# EAGLE design LB_o9_Bargraph-v03(3_3) (EAGLE 6.6.0)
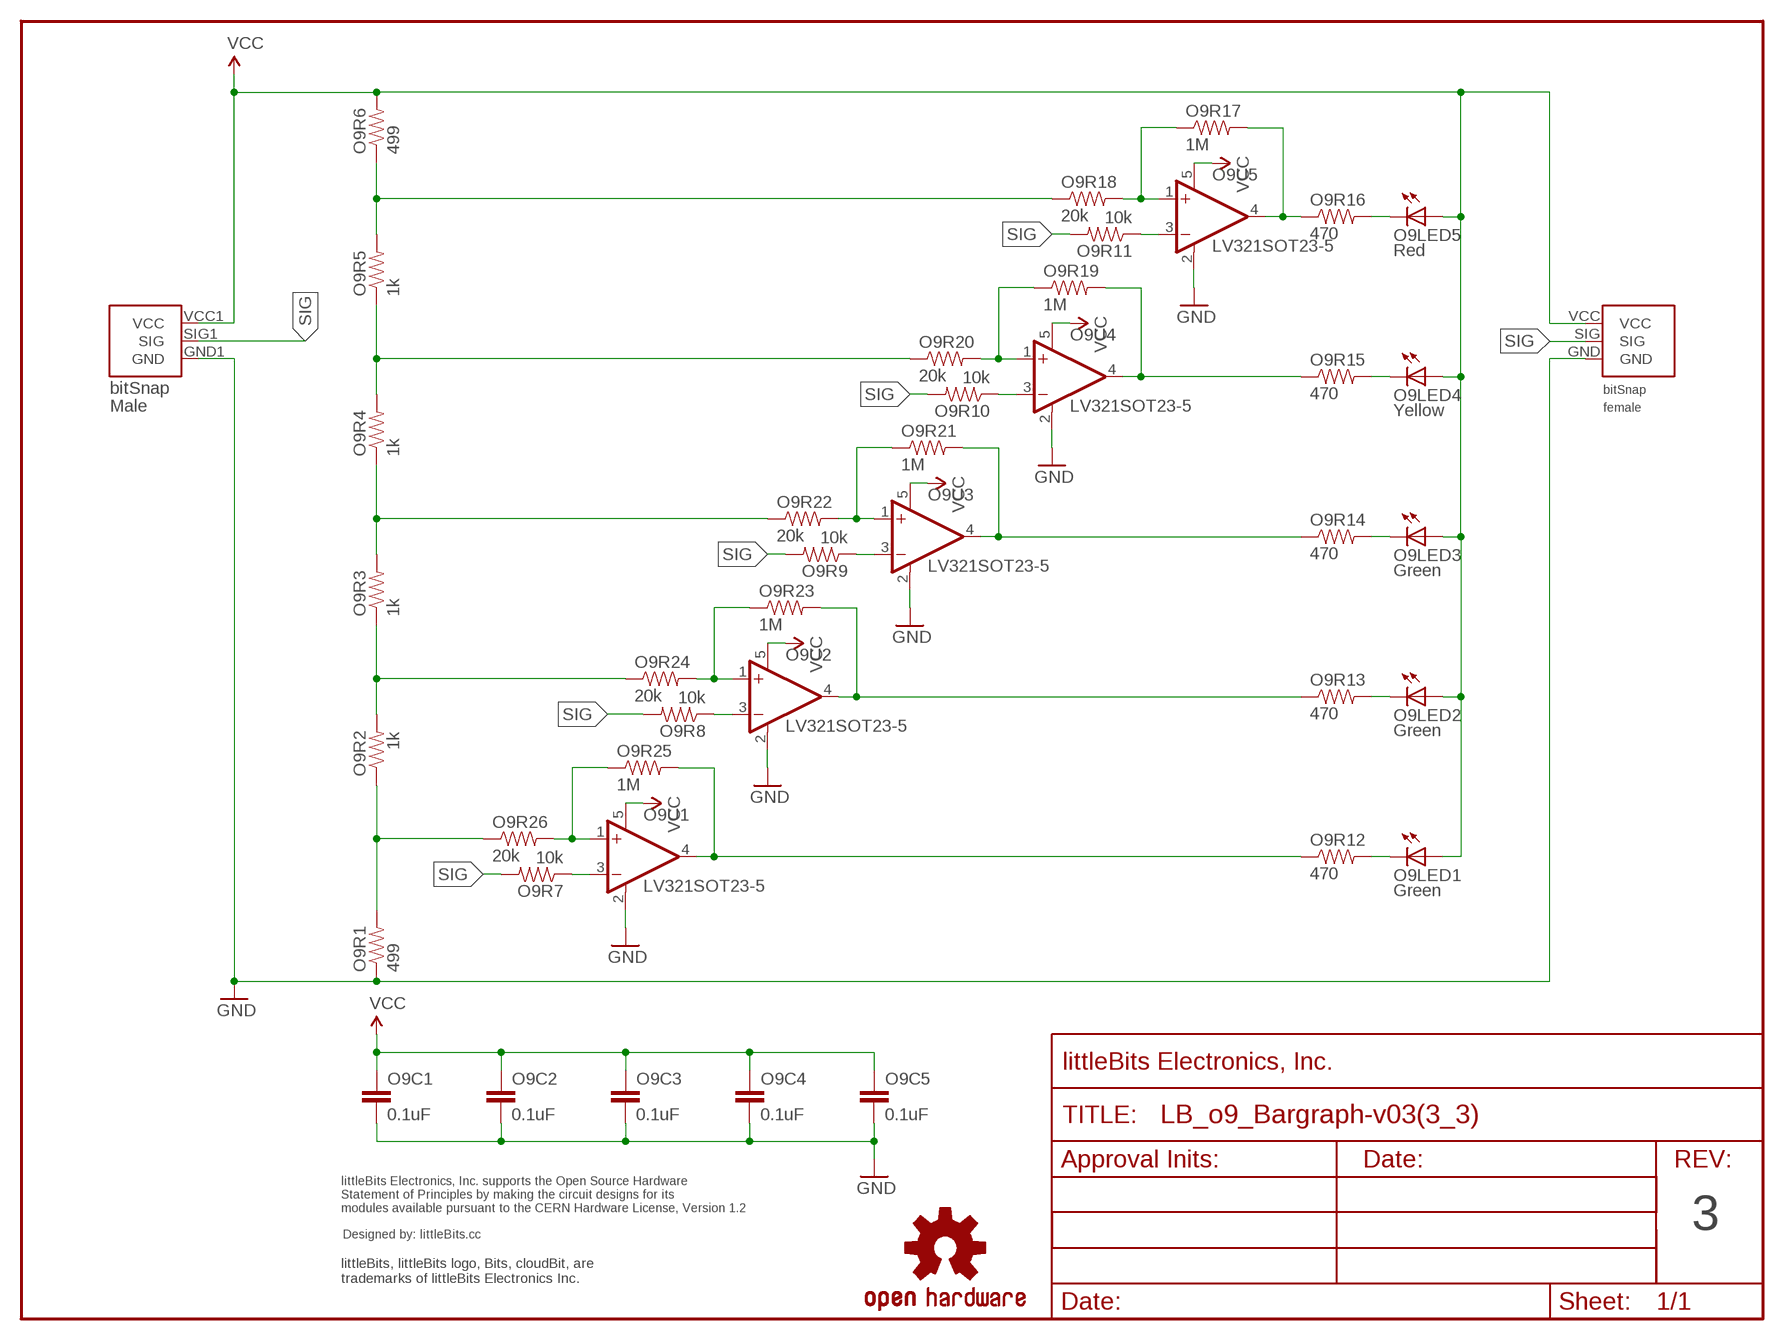
[diagram p0: schematic, sheet 1]

## Parts
09BSF1  BITSNAP_V03_FEMALE  [BITSNAP_V03_FEMALE]
O9BSM1  BITSNAP_V03_MALE  [BITSNAP_V03_MALE]
O9C1  0.1uF  CAP0603-CAP  [0603-CAP]
O9C2  0.1uF  CAP0603-CAP  [0603-CAP]
O9C3  0.1uF  CAP0603-CAP  [0603-CAP]
O9C4  0.1uF  CAP0603-CAP  [0603-CAP]
O9C5  0.1uF  CAP0603-CAP  [0603-CAP]
O9LED1  Green  LED1206  [LED-1206]
O9LED2  Green  LED1206  [LED-1206]
O9LED3  Green  LED1206  [LED-1206]
O9LED4  Yellow  LED1206  [LED-1206]
O9LED5  Red  LED1206  [LED-1206]
O9R1  499  RESISTOR0603-RES  [0603-RES]
O9R2  1k  RESISTOR0603-RES  [0603-RES]
O9R3  1k  RESISTOR0603-RES  [0603-RES]
O9R4  1k  RESISTOR0603-RES  [0603-RES]
O9R5  1k  RESISTOR0603-RES  [0603-RES]
O9R6  499  RESISTOR0603-RES  [0603-RES]
O9R7  10k  RESISTOR0603-RES  [0603-RES]
O9R8  10k  RESISTOR0603-RES  [0603-RES]
O9R9  10k  RESISTOR0603-RES  [0603-RES]
O9R10  10k  RESISTOR0603-RES  [0603-RES]
O9R11  10k  RESISTOR0603-RES  [0603-RES]
O9R12  470  RESISTOR0603-RES  [0603-RES]
O9R13  470  RESISTOR0603-RES  [0603-RES]
O9R14  470  RESISTOR0603-RES  [0603-RES]
O9R15  470  RESISTOR0603-RES  [0603-RES]
O9R16  470  RESISTOR0603-RES  [0603-RES]
O9R17  1M  RESISTOR0603-RES  [0603-RES]
O9R18  20k  RESISTOR0603-RES  [0603-RES]
O9R19  1M  RESISTOR0603-RES  [0603-RES]
O9R20  20k  RESISTOR0603-RES  [0603-RES]
O9R21  1M  RESISTOR0603-RES  [0603-RES]
O9R22  20k  RESISTOR0603-RES  [0603-RES]
O9R23  1M  RESISTOR0603-RES  [0603-RES]
O9R24  20k  RESISTOR0603-RES  [0603-RES]
O9R25  1M  RESISTOR0603-RES  [0603-RES]
O9R26  20k  RESISTOR0603-RES  [0603-RES]
O9U1  LV321SOT23-5  [SOT23-5]
O9U2  LV321SOT23-5  [SOT23-5]
O9U3  LV321SOT23-5  [SOT23-5]
O9U4  LV321SOT23-5  [SOT23-5]
O9U5  LV321SOT23-5  [SOT23-5]
U$1  OSHWCREDIT  [OSHWCREDIT]
U$2  FRAME-LETTER-OHWOHW  [FABDWG01-OHW]
U$4  OSHW-LOGOL  [OSHW-LOGO-L]

## Nets
GND: 09BSF1.GND O9BSM1.GND1(GND) O9C1.2 O9C2.2 O9C3.2 O9C4.2 O9C5.2 O9R1.1 O9U1.2(V-) O9U2.2(V-) O9U3.2(V-) O9U4.2(V-) O9U5.2(V-)
N$1: O9R7.1 O9U1.3(-IN)
N$2: O9LED1.C O9R12.2
N$3: O9LED2.C O9R13.2
N$4: O9LED3.C O9R14.2
N$5: O9LED4.C O9R15.2
N$6: O9R16.1 O9R17.2 O9U5.4(OUT)
N$7: O9R11.1 O9U5.3(-IN)
N$8: O9LED5.C O9R16.2
N$9: O9R17.1 O9R18.2 O9U5.1(+IN)
N$10: O9R15.1 O9R19.2 O9U4.4(OUT)
N$11: O9R10.1 O9U4.3(-IN)
N$12: O9R19.1 O9R20.2 O9U4.1(+IN)
N$13: O9R21.1 O9R22.2 O9U3.1(+IN)
N$14: O9R1.2 O9R2.1 O9R26.1
N$15: O9R2.2 O9R3.1 O9R24.1
N$16: O9R3.2 O9R4.1 O9R22.1
N$17: O9R4.2 O9R5.1 O9R20.1
N$18: O9R9.1 O9U3.3(-IN)
N$19: O9R14.1 O9R21.2 O9U3.4(OUT)
N$20: O9R5.2 O9R6.1 O9R18.1
N$21: O9R8.1 O9U2.3(-IN)
N$22: O9R23.1 O9R24.2 O9U2.1(+IN)
N$23: O9R13.1 O9R23.2 O9U2.4(OUT)
N$24: O9R12.1 O9R25.2 O9U1.4(OUT)
N$26: O9R25.1 O9R26.2 O9U1.1(+IN)
SIG: 09BSF1.SIG O9BSM1.SIG1(SIG) O9R7.2 O9R8.2 O9R9.2 O9R10.2 O9R11.2
VCC: 09BSF1.VCC O9BSM1.VCC1(VCC) O9C1.1 O9C2.1 O9C3.1 O9C4.1 O9C5.1 O9LED1.A O9LED2.A O9LED3.A O9LED4.A O9LED5.A O9R6.2 O9U1.5(V+) O9U2.5(V+) O9U3.5(V+) O9U4.5(V+) O9U5.5(V+)

## Notes on the sheet
- 3

## Library data of the parts
09BSF1 = bitSnap:BITSNAP_V03_FEMALE
O9BSM1 = bitSnap:BITSNAP_V03_MALE
O9C1-O9C5 = SparkFun:CAP: Capacitor Standard 0603 ceramic capacitor, and 0.1" leaded capacitor.
O9LED1-O9LED5 = SparkFun:LED: LEDs Standard schematic elements and footprints for 5mm, 3mm, 1206, and 0603 sized LEDs. 5mm - Spark Fun Electronics SKU : COM-00529 (and others)
O9R1-O9R26 = SparkFun:RESISTOR: Resistor Basic schematic elements and footprints for 0603, 1206, and PTH 1/10th watt (small) resistors.
O9U1-O9U5 = LITTLEBITS:LV321
U$1 = LITTLEBITS:OSHWCREDIT
U$2 = LITTLEBITS:FRAME-LETTER-OHW
U$4 = LITTLEBITS:OSHW-LOGO: Open Source Hardware Logo This logo indicates the piece of hardware it is found on incorporates a OSHW license and/or adheres to the definition of open source hardware found here: http://freedomdefined.org/OSHW

## Board
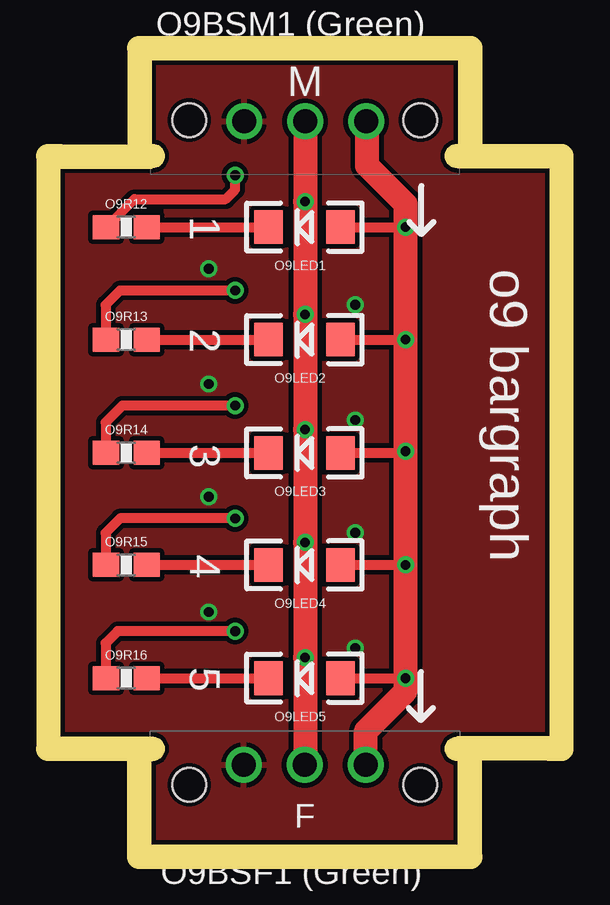
[diagram p1: board, top side]
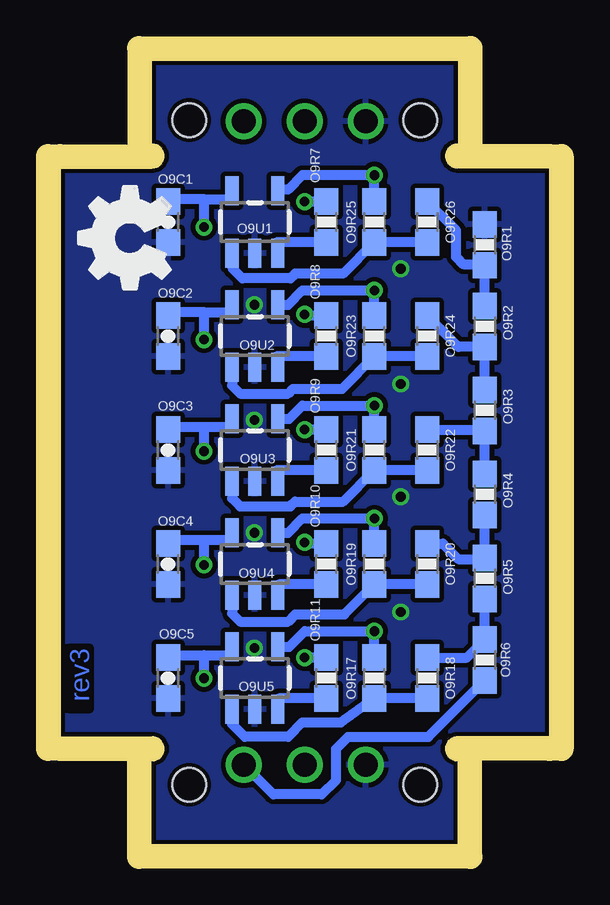
[diagram p2: board, bottom side, seen from below]

Size 20.4 x 32.7 mm. Coordinates in mm from the lower left corner, seen from the top.
Outline: 0,4.5 0,28.2
Outline: 20.4,28.2 20.4,4.5
Copper layers (1*16): Top 0.035mm / dielectric 1.5mm / Bottom 0.035mm
Design rules "default": minimum track width 0.2mm, minimum drill 0.4mm, track to track 0.2mm, track to pad 0.2mm, pad to pad 0.2mm, via to via 0.2mm, smd to smd 0mil, copper to edge 0.2mm, drill to drill 0.2mm, minimum pad ring 0.2mm, minimum via ring 0.15mm, stop-mask expansion 0.1mm, vias tented up to drill 0mil, thermal gap 0.2mm
Milling: 6 lines

### Footprints (pad centres in the part's own frame; a part is rotated, then mirrored left to right if it is on the bottom)
BITSNAP_V03_FEMALE = drill 1: GND 3.91,3.33; SIG 6.45,3.33; VCC 8.99,3.33 | hole 1.4: 1.63,2.5; 11.27,2.5
BITSNAP_V03_MALE = drill 1: GND1 8.98,2.56; SIG1 6.44,2.56; VCC1 3.9,2.56 | hole 1.4: 11.27,2.5; 1.63,2.5
0603-CAP = smd 1.1 x 1: 1 -0.85,0; 2 0.85,0
LED-1206 = smd 1.2 x 1.4: A -1.5,0; C 1.5,0
0603-RES = smd 1.1 x 1: 1 -0.85,0; 2 0.85,0
SOT23-5 = smd 0.55 x 1.2: 1 -0.95,-1.3; 2 0,-1.3; 3 0.95,-1.3; 4 0.95,1.3; 5 -0.95,1.3

### Placement (x,y rotation side)
09BSF1  3.75,0 0 top
O9BSM1  16.65,32.7 180 top
O9C1  15.9,25.95 270 bottom
O9C2  15.9,21.2 270 bottom
O9C3  15.9,16.45 270 bottom
O9C4  15.9,11.7 270 bottom
O9C5  15.9,6.95 270 bottom
O9LED1  10.19,25.74 180 top
O9LED2  10.19,21.05 180 top
O9LED3  10.19,16.33 180 top
O9LED4  10.19,11.66 180 top
O9LED5  10.19,6.94 180 top
O9R1  2.7,25 270 bottom
O9R2  2.7,21.6 270 bottom
O9R3  2.7,18.1 270 bottom
O9R4  2.7,14.6 270 bottom
O9R5  2.7,11.1 270 bottom
O9R6  2.7,7.7 270 bottom
O9R7  9.3,25.95 90 bottom
O9R8  9.3,21.2 90 bottom
O9R9  9.3,16.45 90 bottom
O9R10  9.3,11.7 90 bottom
O9R11  9.3,6.95 90 bottom
O9R12  2.76,25.74 0 top
O9R13  2.76,21.05 0 top
O9R14  2.76,16.33 0 top
O9R15  2.76,11.66 0 top
O9R16  2.76,6.94 0 top
O9R17  7.3,6.95 90 bottom
O9R18  5.1,6.95 270 bottom
O9R19  7.3,11.7 90 bottom
O9R20  5.1,11.7 270 bottom
O9R21  7.3,16.45 90 bottom
O9R22  5.1,16.45 270 bottom
O9R23  7.3,21.2 90 bottom
O9R24  5.1,21.2 270 bottom
O9R25  7.3,25.95 90 bottom
O9R26  5.1,25.95 270 bottom
O9U1  12.28,25.95 0 bottom
O9U2  12.28,21.2 0 bottom
O9U3  12.28,16.45 0 bottom
O9U4  12.28,11.7 0 bottom
O9U5  12.28,6.95 0 bottom
U$1  -93.8,-65.3 0 top  (outside the outline)
U$2  0.1,0.1 0 top
U$4  -31.3,-70.9 0 top  (outside the outline)
U$10  [OSHW_FILLX150_NOTEXT]  15.81,22.33 0 top

### Tracks (layer width: path | path; a pad name or v marks a point on that pad's centre or on a via)
GND  (via drill 0.41)
  other vias: 12.3,22.5 12.3,17.7 12.3,13 12.3,8.2 6.2,24 6.2,19.2 6.2,14.5 6.2,9.7
  pour Top: 0.15,32.54 0.15,0.15 20.22,0.15 20.22,32.54
  pour Bottom: 0.15,32.54 0.15,0.15 20.22,0.15 20.22,32.54
N$1
  Bottom 0.406: O9R7.1 11.38,25.1 O9U1.3
N$2
  Top 0.406: O9R12.2 O9LED1.C
N$3
  Top 0.406: O9R13.2 O9LED2.C
N$4
  Top 0.406: O9R14.2 O9LED3.C
N$5
  Top 0.406: O9R15.2 O9LED4.C
N$6  (via drill 0.41)
  Top 0.406: v7.3,8.9 2.4,8.9 1.9,8.4 1.9,6.95 O9R16.1
  Bottom 0.406: O9U5.4 10.85,8.25 10.2,8.9 v7.3,8.9 O9R17.2
N$7
  Bottom 0.406: O9R11.1 11.28,6.1 O9U5.3
N$8
  Top 0.406: O9R16.2 O9LED5.C
N$9
  Bottom 0.406: O9U5.1 13.23,5.03 12.7,4.5 10.9,4.5 10.3,5.1 8.7,5.1 O9R17.1 O9R18.2
N$10  (via drill 0.41)
  Top 0.406: v7.3,13.6 2.5,13.6 1.9,13 1.9,11.67 O9R15.1
  Bottom 0.406: O9U4.4 10.9,13 10.3,13.6 v7.3,13.6 O9R19.2
N$11
  Bottom 0.406: O9R10.1 11.28,10.85 O9U4.3
N$12
  Bottom 0.406: O9U4.1 13.23,9.63 12.9,9.3 10.9,9.3 10.6,9.6 8.55,9.6 O9R19.1 O9R20.2
N$13
  Bottom 0.406: O9U3.1 13.23,14.43 12.9,14.1 10.8,14.1 10.6,14.3 8.6,14.3 O9R21.1 O9R22.2
N$14
  Bottom 0.406: O9R2.1 O9R1.2 2.75,24.2 3.6,24.2 3.9,24.5 3.9,25.6 O9R26.1
N$15
  Bottom 0.406: O9R3.1 O9R2.2 3.8,20.75 O9R24.1
N$16
  Bottom 0.406: O9R4.1 O9R3.2 2.75,17.3 O9R22.1
N$17
  Bottom 0.406: O9R4.2 O9R5.1 2.75,11.9 3.8,11.9 4.45,12.55 O9R20.1
N$18
  Bottom 0.406: O9R9.1 11.38,15.6 O9U3.3
N$19  (via drill 0.41)
  Top 0.406: v7.3,18.3 2.6,18.3 1.9,17.6 1.9,16.34 O9R14.1
  Bottom 0.406: O9R21.2 v7.3,18.3 10.3,18.3 10.85,17.75 O9U3.4
N$20
  Bottom 0.406: O9R5.2 O9R6.1 3.45,7.8 O9R18.1
N$21
  Bottom 0.406: O9R8.1 11.38,20.35 O9U2.3
N$22
  Bottom 0.406: O9U2.1 13.23,19.13 12.9,18.8 10.9,18.8 10.7,19 8.65,19 O9R23.1 O9R24.2
N$23  (via drill 0.41)
  Top 0.406: O9R13.1 1.9,21.06 1.9,22.5 2.5,23.1 v7.3,23.1
  Bottom 0.406: O9U2.4 10.9,22.5 10.3,23.1 v7.3,23.1 O9R23.2
N$24  (via drill 0.41)
  Top 0.406: O9R12.1 1.94,25.74 3.1,26.9 6.9,26.9 7.3,27.3 v7.3,27.9
  Bottom 0.406: 7.4,26.8 O9R25.2 7.3,27.8 7.2,27.9 v7.3,27.9 10.3,27.9 10.9,27.3 11.28,27.3 O9U1.4
N$26
  Bottom 0.406: O9U1.1 13.2,24.62 13.2,24 12.8,23.6 10.8,23.6 10.6,23.8 8.6,23.8 O9R25.1 O9R26.2
SIG  (via drill 0.41)
  Top 0.406: 09BSF1.SIG
  Top 1: O9BSM1.SIG1 v10.21,26.8 v10.21,22.1 v10.21,17.3 v10.21,12.6 v10.21,7.8 09BSF1.SIG
  Bottom 0.406: O9R7.2 v10.21,26.8 | O9R8.2 10.06,22.05 v10.21,22.1 | O9R9.2 v10.21,17.3 | O9R10.2 10.06,12.55 v10.21,12.6 | O9R11.2 v10.21,7.8
VCC  (via drill 0.41)
  Top 0.406: O9LED1.A v14.4,25.74 | O9LED5.A v14.4,6.94 | O9LED2.A v14.4,21.05 | O9LED3.A 14.4,16.33 v14.4,16.4 | O9LED4.A v14.4,11.66
  Top 1: O9BSM1.VCC1 12.8,30.09 12.8,28.3 14.4,26.7 v14.4,25.74 v14.4,21.05 v14.4,16.4 v14.4,11.66 v14.4,6.94 14.4,6.4 12.74,4.74 09BSF1.VCC
  Bottom 0.406: 2.7,6.7 O9R6.2 5.05,4.5 8.4,4.5 8.9,4 8.9,2.7 9.5,2.1 11.51,2.1 09BSF1.VCC | 14.4,26.9 15.9,26.9 O9C1.1 | v14.4,25.74 14.4,26.9 | 14.4,26.9 13.23,26.9 O9U1.5 | v14.4,6.94 14.4,7.9 | 14.4,7.9 13.23,7.9 O9U5.5 | O9C5.1 15.9,7.9 14.4,7.9 | v14.4,11.66 14.4,12.7 | 14.4,12.7 15.9,12.7 O9C4.1 | O9U4.5 13.3,13 13.3,12.7 14.4,12.7 | v14.4,16.4 14.4,17.4 | 14.4,17.4 15.9,17.4 O9C3.1 | O9U3.5 13.3,17.75 13.3,17.4 14.4,17.4 | v14.4,21.05 14.4,22.2 | 14.4,22.2 13.23,22.2 O9U2.5 | 14.4,22.2 15.9,22.2 O9C2.1

### Text on the board
Bottom: rev3
tPlace: 1 | o9 bargraph | 2 | 3 | 4 | 5
tNames: O9BSM1 (Green) | O9BSF1 (Green)
Milling: 1mm DIA. ROUTER PATH
dxf: 3 | Bargraph bit